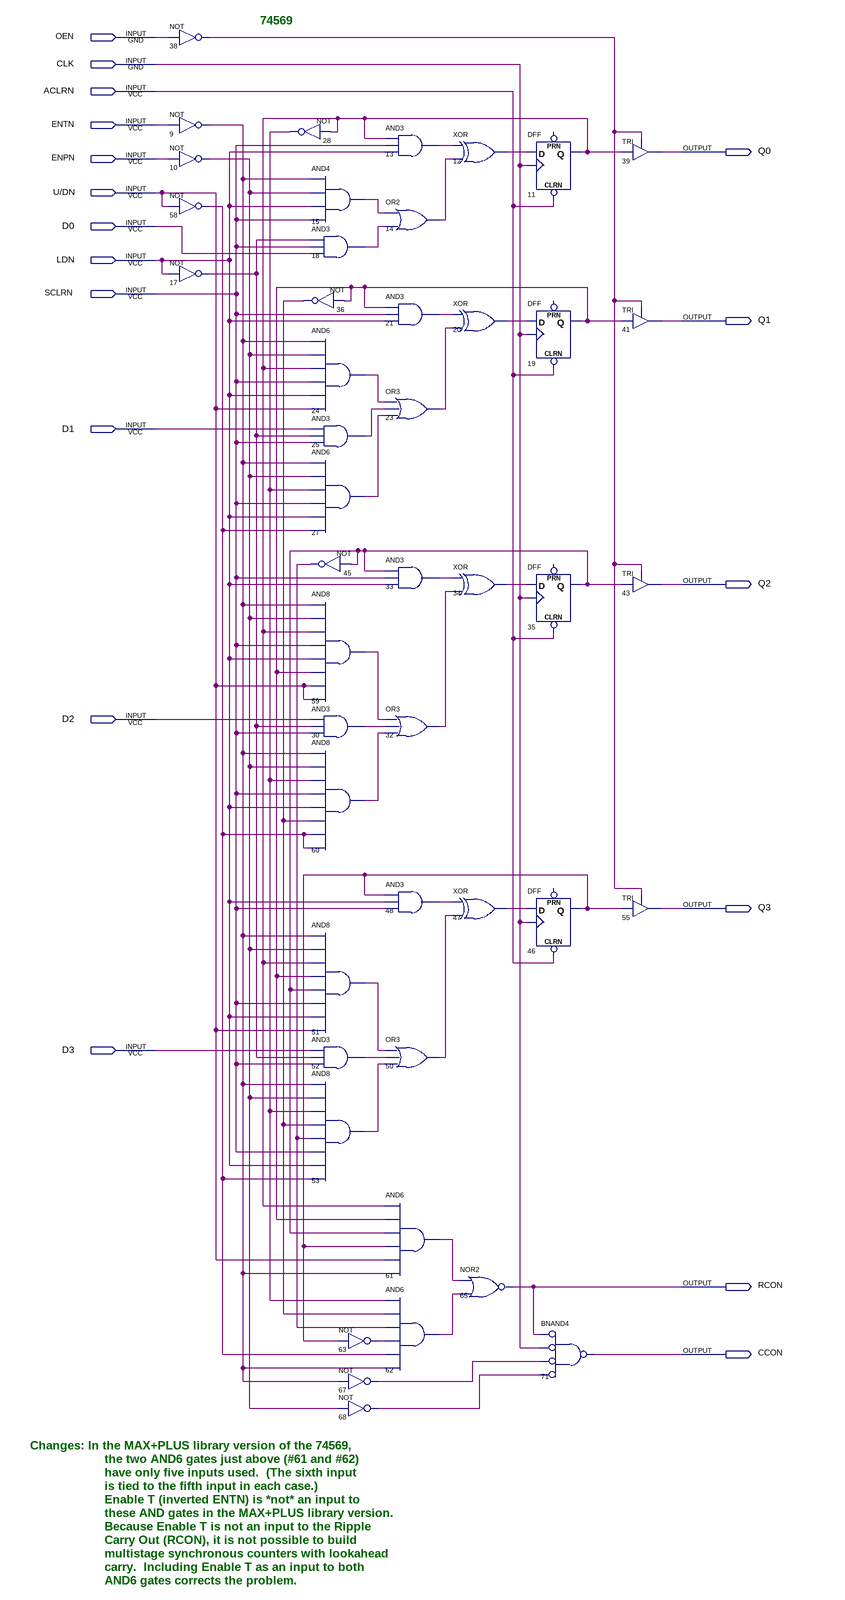
[diagram p0: schematic sheet]
// Quartus schematic 74569.bdf as structural Verilog: 46 symbols, 18 pins
module \74569  (
  input  OEN,
  input  CLK,
  input  ACLRN,
  input  ENTN,
  input  ENPN,
  input  \U/DN ,
  input  D0,
  input  LDN,
  input  SCLRN,
  input  D1,
  input  D2,
  input  D3,
  output Q0,
  output Q1,
  output Q2,
  output Q3,
  output RCON,
  output CCON
);

  wire n9_out, n10_out, n11_q, n12_out, n13_out, n14_out, n15_out, n17_out, n18_out, n19_q, n20_out, n21_out,
       n23_out, n24_out, n25_out, n27_out, n28_out, n30_out, n32_out, n33_out, n34_out, n35_q, n36_out,
       n38_out, n45_out, n46_q, n47_out, n48_out, n50_out, n51_out, n52_out, n53_out, n58_out, n59_out,
       n60_out, n61_out, n62_out, n63_out, n67_out, n68_out;

  not u_38 (n38_out, OEN);
  not u_9 (n9_out, ENTN);
  not u_10 (n10_out, ENPN);
  not u_58 (n58_out, \U/DN );
  not u_17 (n17_out, LDN);
  not u_28 (n28_out, n11_q);
  and u_15 (n15_out, n9_out, n10_out, LDN, SCLRN);
  and u_18 (n18_out, n17_out, SCLRN, D0);
  not u_36 (n36_out, n19_q);
  and u_24 (n24_out, n9_out, n10_out, n11_q, SCLRN, LDN, \U/DN );
  and u_25 (n25_out, D1, n17_out, SCLRN);
  and u_27 (n27_out, n9_out, n10_out, n28_out, SCLRN, LDN, n58_out);
  not u_45 (n45_out, n35_q);
  and u_59 (n59_out, n9_out, n10_out, n11_q, SCLRN, LDN, n19_q, \U/DN , \U/DN );
  and u_30 (n30_out, D2, n17_out, SCLRN);
  and u_60 (n60_out, n9_out, n10_out, n28_out, SCLRN, LDN, n36_out, n58_out, n58_out);
  and u_51 (n51_out, n9_out, n10_out, n11_q, n19_q, n35_q, SCLRN, LDN, \U/DN );
  and u_52 (n52_out, D3, n17_out, SCLRN);
  and u_53 (n53_out, n9_out, n10_out, n28_out, n36_out, n45_out, SCLRN, LDN, n58_out);
  not u_63 (n63_out, n46_q);
  not u_67 (n67_out, n9_out);
  not u_68 (n68_out, n10_out);
  and u_13 (n13_out, n11_q, SCLRN, LDN);
  or u_14 (n14_out, n15_out, n18_out);
  and u_21 (n21_out, n19_q, SCLRN, LDN);
  or u_23 (n23_out, n24_out, n25_out, n27_out);
  and u_33 (n33_out, n35_q, SCLRN, LDN);
  or u_32 (n32_out, n59_out, n30_out, n60_out);
  and u_48 (n48_out, n46_q, LDN, SCLRN);
  or u_50 (n50_out, n51_out, n52_out, n53_out);
  and u_61 (n61_out, n11_q, n19_q, n35_q, n46_q, \U/DN , n9_out);
  and u_62 (n62_out, n28_out, n36_out, n45_out, n63_out, n58_out, n9_out);
  xor u_12 (n12_out, n13_out, n14_out);
  xor u_20 (n20_out, n21_out, n23_out);
  xor u_34 (n34_out, n33_out, n32_out);
  xor u_47 (n47_out, n48_out, n50_out);
  nor u_65 (RCON, n61_out, n62_out);
  DFF u_11 (.CLRN(ACLRN), .CLK(CLK), .D(n12_out), .Q(n11_q));  // open: PRN
  DFF u_19 (.CLRN(ACLRN), .CLK(CLK), .D(n20_out), .Q(n19_q));  // open: PRN
  DFF u_35 (.CLRN(ACLRN), .CLK(CLK), .D(n34_out), .Q(n35_q));  // open: PRN
  DFF u_46 (.CLRN(ACLRN), .CLK(CLK), .D(n47_out), .Q(n46_q));  // open: PRN
  nand u_71 (CCON, ~RCON, ~CLK, ~n67_out, ~n68_out);  // BNAND4
  TRI u_39 (.IN(n11_q), .OE(n38_out), .OUT(Q0));
  TRI u_41 (.IN(n19_q), .OE(n38_out), .OUT(Q1));
  TRI u_43 (.IN(n35_q), .OE(n38_out), .OUT(Q2));
  TRI u_55 (.IN(n46_q), .OE(n38_out), .OUT(Q3));

  // Notes on the sheet:
  //   74569
  //   Changes: In the MAX+PLUS library version of the 74569,
  //   the two AND6 gates just above (#61 and #62)
  //   have only five inputs used.  (The sixth input
  //   is tied to the fifth input in each case.)
  //   Enable T (inverted ENTN) is *not* an input to
  //   these AND gates in the MAX+PLUS library version.
  //   Because Enable T is not an input to the Ripple
  //   Carry Out (RCON), it is not possible to build
  //   multistage synchronous counters with lookahead
  //   carry.  Including Enable T as an input to both
  //   AND6 gates corrects the problem.
endmodule
